# EAGLE design DMD-RaspberryPi (EAGLE 7.7.0)
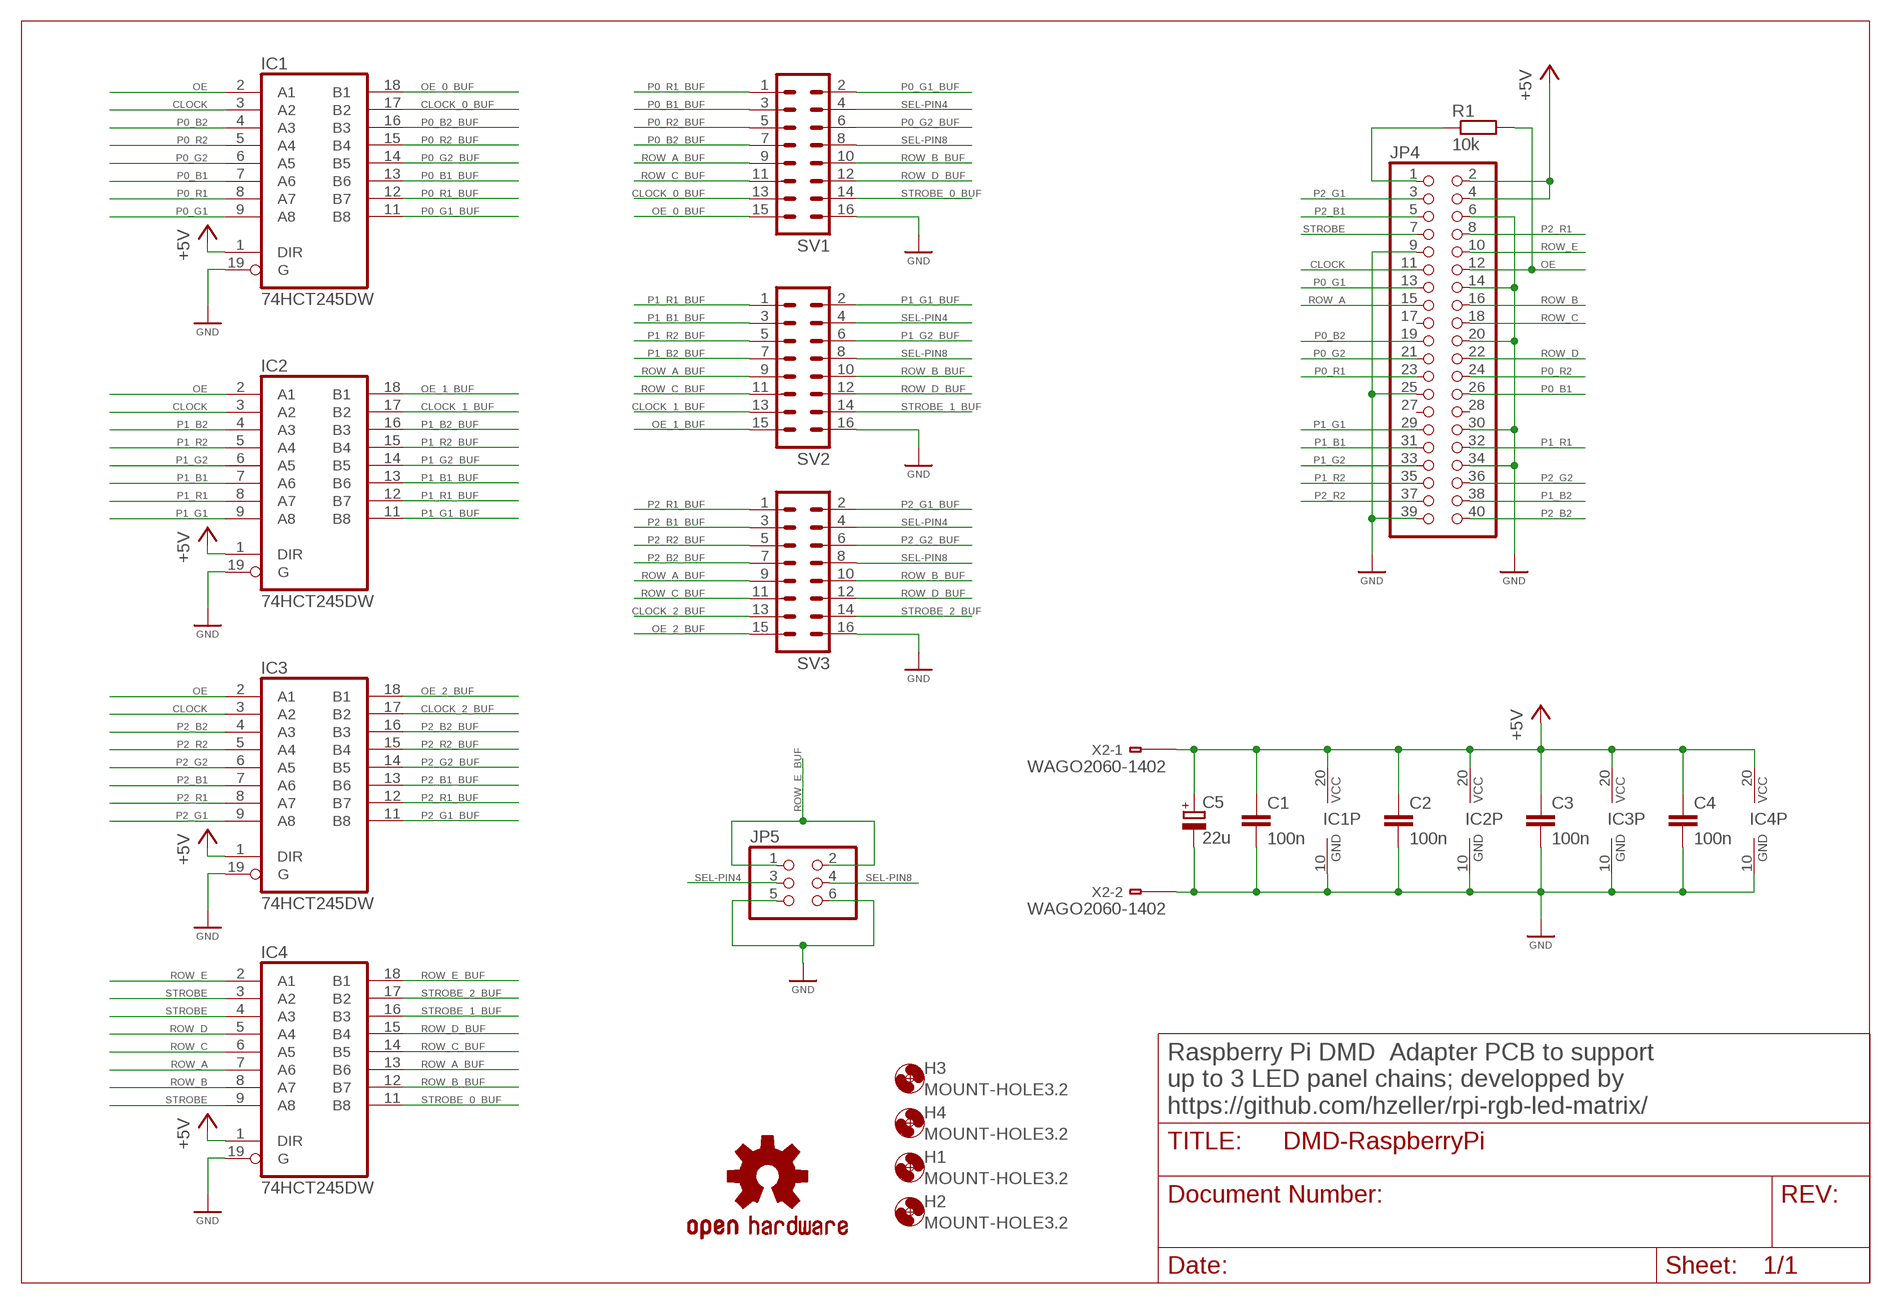
[diagram p0: schematic, sheet 1]

## Parts
C1  100n  C-EUC0805  [C0805]
C2  100n  C-EUC0805  [C0805]
C3  100n  C-EUC0805  [C0805]
C4  100n  C-EUC0805  [C0805]
C5  22u  CPOL-EUC  [PANASONIC_C]
H1  MOUNT-HOLE3.2  [3,2]
H2  MOUNT-HOLE3.2  [3,2]
H3  MOUNT-HOLE3.2  [3,2]
H4  MOUNT-HOLE3.2  [3,2]
IC1  74HCT245DW  [SO20W]
IC2  74HCT245DW  [SO20W]
IC3  74HCT245DW  [SO20W]
IC4  74HCT245DW  [SO20W]
JP4  PINHD-2X20  [2X20]
JP5  PINHD-2X3  [2X03]
LOGO1  OSHW-LOGOL-COPPER  [OSHW-LOGO-L_COPPER]
R1  10k  R-EU_R0805  [R0805]
SV1  ML16  [ML16]
SV2  ML16  [ML16]
SV3  ML16  [ML16]
X2  WAGO2060-1402  [THT_RM4_2]

## Nets
+5V: C1.1 C2.1 C3.1 C4.1 C5.+ IC1.1(DIR) IC1.20(VCC) IC2.1(DIR) IC2.20(VCC) IC3.1(DIR) IC3.20(VCC) IC4.1(DIR) IC4.20(VCC) JP4.2 JP4.4 X2.A2(-1:PIN)
CLOCK: IC1.3(A2) IC2.3(A2) IC3.3(A2) JP4.11
CLOCK_0_BUF: IC1.17(B2) SV1.13
CLOCK_1_BUF: IC2.17(B2) SV2.13
CLOCK_2_BUF: IC3.17(B2) SV3.13
GND: C1.2 C2.2 C3.2 C4.2 C5.- IC1.10(GND) IC1.19(G) IC2.10(GND) IC2.19(G) IC3.10(GND) IC3.19(G) IC4.10(GND) IC4.19(G) JP4.6 JP4.9 JP4.14 JP4.20 JP4.25 JP4.30 JP4.34 JP4.39 JP5.5 JP5.6 SV1.16 SV2.16 SV3.16 X2.B2(-2:PIN)
N$6: JP4.1 R1.1
OE: IC1.2(A1) IC2.2(A1) IC3.2(A1) JP4.12 R1.2
OE_0_BUF: IC1.18(B1) SV1.15
OE_1_BUF: IC2.18(B1) SV2.15
OE_2_BUF: IC3.18(B1) SV3.15
P0_B1: IC1.7(A6) JP4.26
P0_B1_BUF: IC1.13(B6) SV1.3
P0_B2: IC1.4(A3) JP4.19
P0_B2_BUF: IC1.16(B3) SV1.7
P0_G1: IC1.9(A8) JP4.13
P0_G1_BUF: IC1.11(B8) SV1.2
P0_G2: IC1.6(A5) JP4.21
P0_G2_BUF: IC1.14(B5) SV1.6
P0_R1: IC1.8(A7) JP4.23
P0_R1_BUF: IC1.12(B7) SV1.1
P0_R2: IC1.5(A4) JP4.24
P0_R2_BUF: IC1.15(B4) SV1.5
P1_B1: IC2.7(A6) JP4.31
P1_B1_BUF: IC2.13(B6) SV2.3
P1_B2: IC2.4(A3) JP4.38
P1_B2_BUF: IC2.16(B3) SV2.7
P1_G1: IC2.9(A8) JP4.29
P1_G1_BUF: IC2.11(B8) SV2.2
P1_G2: IC2.6(A5) JP4.33
P1_G2_BUF: IC2.14(B5) SV2.6
P1_R1: IC2.8(A7) JP4.32
P1_R1_BUF: IC2.12(B7) SV2.1
P1_R2: IC2.5(A4) JP4.35
P1_R2_BUF: IC2.15(B4) SV2.5
P2_B1: IC3.7(A6) JP4.5
P2_B1_BUF: IC3.13(B6) SV3.3
P2_B2: IC3.4(A3) JP4.40
P2_B2_BUF: IC3.16(B3) SV3.7
P2_G1: IC3.9(A8) JP4.3
P2_G1_BUF: IC3.11(B8) SV3.2
P2_G2: IC3.6(A5) JP4.36
P2_G2_BUF: IC3.14(B5) SV3.6
P2_R1: IC3.8(A7) JP4.8
P2_R1_BUF: IC3.12(B7) SV3.1
P2_R2: IC3.5(A4) JP4.37
P2_R2_BUF: IC3.15(B4) SV3.5
ROW_A: IC4.7(A6) JP4.15
ROW_A_BUF: IC4.13(B6) SV1.9 SV2.9 SV3.9
ROW_B: IC4.8(A7) JP4.16
ROW_B_BUF: IC4.12(B7) SV1.10 SV2.10 SV3.10
ROW_C: IC4.6(A5) JP4.18
ROW_C_BUF: IC4.14(B5) SV1.11 SV2.11 SV3.11
ROW_D: IC4.5(A4) JP4.22
ROW_D_BUF: IC4.15(B4) SV1.12 SV2.12 SV3.12
ROW_E: IC4.2(A1) JP4.10
ROW_E_BUF: IC4.18(B1) JP5.1 JP5.2
SEL-PIN4: JP5.3 SV1.4 SV2.4 SV3.4
SEL-PIN8: JP5.4 SV1.8 SV2.8 SV3.8
STROBE: IC4.3(A2) IC4.4(A3) IC4.9(A8) JP4.7
STROBE_0_BUF: IC4.11(B8) SV1.14
STROBE_1_BUF: IC4.16(B3) SV2.14
STROBE_2_BUF: IC4.17(B2) SV3.14
Unconnected: JP4.17 JP4.27 JP4.28 X2.A1(-1:PIN) X2.B1(-2:PIN)

## Notes on the sheet
- Raspberry Pi DMD  Adapter PCB to support
  up to 3 LED panel chains; developped by
  https://github.com/hzeller/rpi-rgb-led-matrix/

## Library data of the parts
C1-C4 = rcl:C-EU: CAPACITOR, European symbol
C5 = rcl:CPOL-EU: POLARIZED CAPACITOR, European symbol
H1-H4 = holes:MOUNT-HOLE: MOUNTING HOLE with drill center marker
IC1-IC4 = 74xx-eu:74*245: Octal BUS TRANSCEIVER, 3-state
JP4 = pinheader:PINHD-2X20: PIN HEADER
JP5 = pinhead:PINHD-2X3: PIN HEADER
LOGO1 = SparkFun-Aesthetics:OSHW-LOGO: Open-Source Hardware (OSHW) Logo This logo indicates the piece of hardware it is found on incorporates a OSHW license and/or adheres to the definition of open source hardware found here: http://freedomdefined.org/OSHW
R1 = resistor:R-EU_: RESISTOR, European symbol
SV1-SV3 = con-harting-ml:ML16: HARTING; OC_FARNELL: unknown; OC_NEWARK: unknown
X2 = con-wago-2060:WAGO2060-1402: WAGO Cage Clamp THR-Leiterplattenklemmen mit Betätigungsdrückern, 0,75 mm2 Eindrähtige Leiter anschließen – direkt stecken. Feindrähtige Leiter anschließen und Leiter lösen – durch geringen Druck auf den Betätigungsdrücker, z.B. mit Betätigungswerkzeug 206-860. Klemmen polverlustfrei nebeneinander positionierbar. Rastermaß 4 mm / 0.157 in 0,2 – 0,75 mm2 AWG 24 – 18 160 V/2,5 kV/2 9 A lichtgrau: 1pol. 2060-1401 / 2pol. 2060-1402 / 3pol. 2060-1403 schwarz: 1pol. 2060-1421 / 2pol. 2060-1422 / 3pol. 2060-1423

## Board
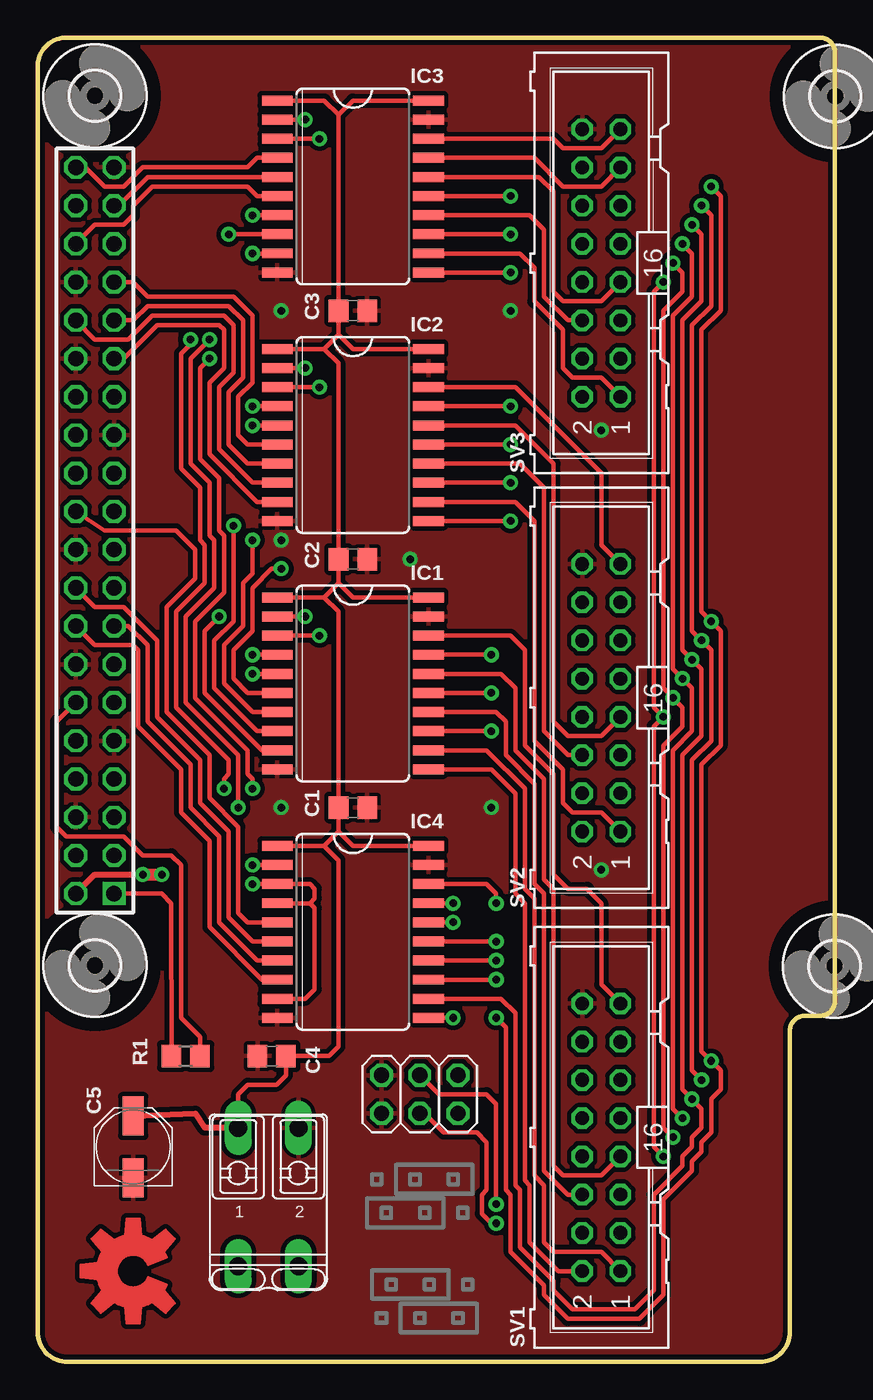
[diagram p1: board, top side]
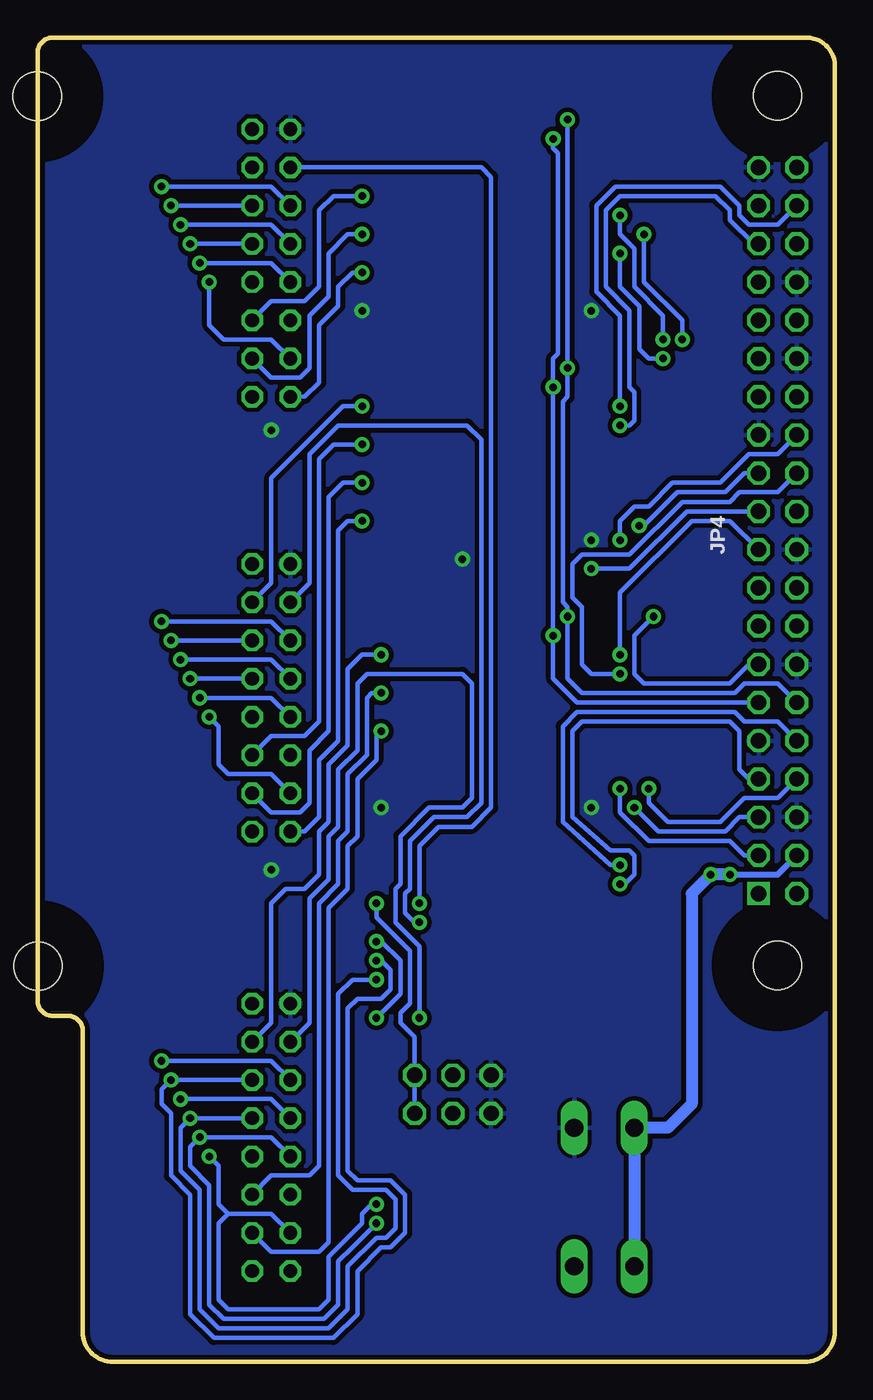
[diagram p2: board, bottom side, seen from below]

Size 53 x 88 mm. Coordinates in mm from the lower left corner, seen from the top.
Outline: 53,86.25 53,87 arc90 52,88 2,88 arc95 0,86 0,2 arc90 2,0 48,0 arc90 50,2 50,22 arc-90 51,23 52,23 arc90 53,24 53,24.25 53,86.25
Outline: 53,86.25 53,85.85
Copper layers (1*16): Top 0.035mm / dielectric 1.5mm / Bottom 0.035mm
Design rules "Elecrow_2-layer_eagle_rule": minimum track width 6mil, minimum drill 12mil, track to track 6mil, track to pad 6mil, pad to pad 6mil, via to via 6mil, smd to smd 0mil, copper to edge 10mil, drill to drill 10mil, minimum pad ring 10mil, minimum via ring 6mil, stop-mask expansion 2mil, vias tented up to drill 100mil, thermal gap 10mil

### Footprints (pad centres in the part's own frame; a part is rotated, then mirrored left to right if it is on the bottom)
C0805 = smd 1.3 x 1.5: 1 -0.95,0; 2 0.95,0
PANASONIC_C = smd 2.6 x 1.4: + 2.05,0; - -2.05,0
3,2 = hole 3.2: 0,0
SO20W = smd 0.66 x 2.032: 1 -5.715,-5.029; 2 -4.445,-5.029; 3 -3.175,-5.029; 4 -1.905,-5.029; 5 -0.635,-5.029; 6 0.635,-5.029; 7 1.905,-5.029; 8 3.175,-5.029; 9 4.445,-5.029; 10 5.715,-5.029; 11 5.715,5.029; 12 4.445,5.029; 13 3.175,5.029; 14 1.905,5.029; 15 0.635,5.029; 16 -0.635,5.029; 17 -1.905,5.029; 18 -3.175,5.029; 19 -4.445,5.029; 20 -5.715,5.029
2X20 = drill 1.016 square: 1 -24.13,-1.27 | drill 1.016 octagon: 2 -24.13,1.27; 3 -21.59,-1.27; 4 -21.59,1.27; 5 -19.05,-1.27; 6 -19.05,1.27; 7 -16.51,-1.27; 8 -16.51,1.27; 9 -13.97,-1.27; 10 -13.97,1.27; 11 -11.43,-1.27; 12 -11.43,1.27; 13 -8.89,-1.27; 14 -8.89,1.27; 15 -6.35,-1.27; 16 -6.35,1.27; 17 -3.81,-1.27; 18 -3.81,1.27; 19 -1.27,-1.27; 20 -1.27,1.27; 21 1.27,-1.27; 22 1.27,1.27; 23 3.81,-1.27; 24 3.81,1.27; 25 6.35,-1.27; 26 6.35,1.27; 27 8.89,-1.27; 28 8.89,1.27; 29 11.43,-1.27; 30 11.43,1.27; 31 13.97,-1.27; 32 13.97,1.27; 33 16.51,-1.27; 34 16.51,1.27; 35 19.05,-1.27; 36 19.05,1.27; 37 21.59,-1.27; 38 21.59,1.27; 39 24.13,-1.27; 40 24.13,1.27
2X03 = drill 1.016 octagon: 1 -2.54,-1.27; 2 -2.54,1.27; 3 0,-1.27; 4 0,1.27; 5 2.54,-1.27; 6 2.54,1.27
R0805 = smd 1.3 x 1.5: 1 -0.95,0; 2 0.95,0
ML16 = drill 0.914 octagon: 1 -8.89,-1.27; 2 -8.89,1.27; 3 -6.35,-1.27; 4 -6.35,1.27; 5 -3.81,-1.27; 6 -3.81,1.27; 7 -1.27,-1.27; 8 -1.27,1.27; 9 1.27,-1.27; 10 1.27,1.27; 11 3.81,-1.27; 12 3.81,1.27; 13 6.35,-1.27; 14 6.35,1.27; 15 8.89,-1.27; 16 8.89,1.27
THT_RM4_2 = drill 1.2 long: A1 0,0; A2 0,9.2; B1 4,0; B2 4,9.2

### Placement (x,y rotation side)
C1  20.95,36.83 0 top
C2  20.95,53.34 0 top
C3  20.95,69.85 0 top
C4  15.56,20.32 180 top
C5  6.35,14.29 90 top
H1  3.81,84.14 0 top
H2  3.81,26.35 0 top
H3  53.03,84.1 0 top
H4  52.97,26.3 0 top
IC1  20.95,45.09 270 top
IC2  20.95,61.59 270 top
IC3  20.95,78.11 270 top
IC4  20.95,28.57 270 top
JP4  3.81,55.24 90 top
JP5  25.4,17.78 180 top
LOGO1  6.35,6.03 90 top
R1  9.84,20.32 0 top
SV1  37.47,14.92 90 top
SV2  37.47,44.13 90 top
SV3  37.47,73.03 90 top
X2  13.34,6.35 0 top

### Tracks (layer width: path | path; a pad name or v marks a point on that pad's centre or on a via)
+5V  (via drill 0.5 pad 1)
  Top 0.305: IC2.1 19.05,67.31 | 19.05,67.31 20,68.26 | 19.05,67.31 20,66.36 C2.1 20,51.75 | 19.05,50.8 20,49.85 C1.1 20,35.24 | 19.05,50.8 IC1.1 | 20,51.75 19.05,50.8 | 19.05,34.29 20,33.34 20,20.95 19.37,20.32 C4.1 | 19.05,34.29 IC4.1 | 20,35.24 19.05,34.29 | 20,68.26 C3.1 20,82.87 | 20,68.26 20.95,67.31 IC2.20 | 20,82.87 19.05,83.82 IC3.1 | 20,82.87 20.95,83.82 IC3.20 | IC1.20 20.95,50.8 20,51.75 | IC4.20 20.95,34.29 20,35.24 | C4.1 | X2.A2 13.34,17.78 13.97,18.41 15.88,18.41 16.51,19.05 C4.1
  Top 0.406: C5.+ 10.48,16.51 11.11,15.56 X2.A2 | JP4.2 3.81,32.38 v6.99,32.38
  Top 0.813: v6.99,32.38 v8.26,32.38
  Bottom 0.406: v6.99,32.38 3.81,32.38 JP4.4
  Bottom 0.813: v6.99,32.38 v8.26,32.38 9.53,31.11 9.53,17.14 11.11,15.56 X2.A2 13.34,6.35
CLOCK  (via drill 0.5 pad 1)
  Top 0.305: IC1.3 v18.73,48.26 | v18.73,64.77 IC2.3 | IC3.3 v18.73,81.28
  Bottom 0.305: JP4.11 17.14,43.81 18.73,45.4 v18.73,48.26 v18.73,64.77 18.73,66.67 18.41,66.99 18.41,80.33 18.73,80.64 v18.73,81.28
CLOCK_0_BUF  (via drill 0.5 pad 1)
  Top 0.305: IC1.17 27.3,46.99 27.94,46.99 29.84,46.99 v30.16,46.99
  Bottom 0.305: v30.16,46.99 31.43,46.99 32.38,46.04 32.38,40.96 33.66,39.69 33.66,35.88 34.29,35.24 34.29,32.38 35.24,31.43 36.51,31.43 37.47,30.48 37.47,22.54 SV1.13
CLOCK_1_BUF  (via drill 0.5 pad 1)
  Top 0.305: IC2.17 27.3,63.5 27.62,63.5 31.11,63.5 v31.43,63.5
  Bottom 0.305: SV2.13 37.47,51.75 37.47,58.74 32.7,63.5 v31.43,63.5
CLOCK_2_BUF
  Top 0.305: IC3.17 27.3,80.01 27.94,80.01 33.02,80.01 34.92,78.11 37.47,78.11 SV3.13
GND  (via drill 0.5 pad 1)
  other vias: 16.19,54.61 16.19,69.85 16.19,36.83 24.77,53.34 30.16,36.83 31.43,69.85 37.47,61.91 37.47,32.7
  pour Top (isolate 0.305): -7.62,94.09 -7.62,-9.46 63.5,-9.14 63.5,94.09
  pour Bottom (isolate 0.305): -7.62,94.73 -7.62,-9.14 63.18,-9.46 63.18,94.41
N$6
  Top 0.305: R1.1 8.89,30.48 8.26,31.11 JP4.1
OE  (via drill 0.5 pad 1)
  Top 0.305: IC3.2 v17.78,82.55 | v17.78,66.04 IC2.2 | IC1.2 v17.78,49.53 | JP4.12 1.27,42.55 1.27,35.56 1.91,34.92 5.71,34.92 6.99,33.66 8.89,33.66 9.53,33.02 9.53,22.86 10.79,21.59 R1.2
  Bottom 0.305: v17.78,82.55 v17.78,66.04 17.78,64.14 18.1,63.82 18.1,50.48 17.78,50.16 v17.78,49.53 17.78,45.4 16.83,44.45 6.67,44.45 6.03,45.09 3.81,45.09 JP4.12
OE_0_BUF
  Top 0.305: IC1.18 27.3,48.26 27.62,48.26 27.94,48.26 31.43,48.26 32.38,47.31 32.38,40.96 34.29,39.05 34.29,32.38 35.24,31.43 36.51,31.43 37.47,30.48 37.47,25.08 SV1.15
OE_1_BUF
  Top 0.305: IC2.18 27.3,64.77 31.75,64.77 32.38,64.14 37.47,59.05 37.47,58.42 37.47,54.29 SV2.15
OE_2_BUF
  Top 0.305: IC3.18 27.3,81.28 34.29,81.28 | 34.29,81.28 34.92,80.64 | 34.92,80.64 34.29,81.28 | 34.29,81.28 34.92,80.64 | 34.92,80.64 37.47,80.64 SV3.15
P0_B1  (via drill 0.5 pad 1)
  Top 0.305: IC1.7 14.29,43.18 12.38,45.09 12.38,47.62 13.65,48.9 13.65,51.75 14.29,52.39 v14.29,54.61
  Bottom 0.305: JP4.26 3.81,60.33 5.71,60.33 7.62,58.42 10.79,58.42 12.38,56.83 13.34,56.83 14.29,55.88 v14.29,54.61
P0_B1_BUF  (via drill 0.5 pad 1)
  Top 0.305: IC1.13 27.3,41.91 29.53,41.91 v30.16,41.91
  Bottom 0.305: v30.16,41.91 30.48,41.59 30.48,40.01 31.75,38.73 31.75,34.92 32.38,34.29 32.38,31.43 33.66,30.16 33.66,7.94 34.29,7.3 37.47,7.3 SV1.3
P0_B2  (via drill 0.5 pad 1)
  Top 0.305: IC1.4 v14.29,46.99
  Bottom 0.305: v14.29,46.99 14.29,51.12 9.53,55.88 6.99,55.88 JP4.19
P0_B2_BUF
  Top 0.305: IC1.16 27.3,45.72 30.8,45.72 31.75,44.77 31.75,40.64 33.66,38.73 33.66,32.07 34.29,31.43 34.29,13.02 34.92,12.38 37.47,12.38 SV1.7
P0_G1  (via drill 0.5 pad 1)
  Top 0.305: IC1.9 14.92,40.64 11.11,44.45 11.11,48.58 v12.06,49.53
  Bottom 0.305: JP4.13 5.71,46.35 6.99,45.09 12.7,45.09 13.34,45.72 13.34,48.26 v12.06,49.53
P0_G1_BUF
  Top 0.305: IC1.11 30.16,39.37 31.75,37.78 31.75,31.11 32.38,30.48 32.38,12.06 32.7,11.75 32.7,7.94 34.61,6.03 SV1.2
P0_G2  (via drill 0.5 pad 1)
  Top 0.305: IC1.6 13.97,44.45 13.02,45.4 13.02,47.31 14.29,48.58 14.29,51.44 15.56,52.7 v16.19,52.7
  Bottom 0.305: JP4.21 9.84,56.52 13.65,52.7 v16.19,52.7
P0_G2_BUF
  Top 0.305: IC1.14 27.3,43.18 30.48,43.18 31.11,42.55 31.11,40.32 33.02,38.42 33.02,31.75 33.66,31.11 33.66,12.7 35.24,11.11 SV1.6
P0_R1  (via drill 0.5 pad 1)
  Top 0.305: IC1.8 14.61,41.91 11.75,44.77 11.75,47.94 13.02,49.21 v13.02,55.56
  Bottom 0.305: JP4.23 6.03,59.05 7.3,57.78 10.48,57.78 12.7,55.56 v13.02,55.56
P0_R1_BUF
  Top 0.305: IC1.12 26.99,40.64 29.84,40.64 32.38,38.1 32.38,31.43 33.02,30.8 33.02,12.38 33.66,11.75 33.66,7.94 34.29,7.3 37.47,7.3 SV1.1
P0_R2  (via drill 0.5 pad 1)
  Top 0.305: IC1.5 v14.29,45.72
  Bottom 0.305: JP4.24 3.81,57.78 6.35,57.78 6.99,57.15 10.16,57.15 13.65,53.66 16.83,53.66 17.46,53.02 17.46,50.8 16.83,50.16 16.83,46.35 16.19,45.72 v14.29,45.72
P0_R2_BUF  (via drill 0.5 pad 1)
  Top 0.305: IC1.15 27.3,44.45 27.62,44.45 29.84,44.45 v30.16,44.45
  Bottom 0.305: v30.16,44.45 30.8,44.45 31.11,44.13 31.11,40.32 32.38,39.05 32.38,35.24 33.02,34.61 33.02,31.75 34.29,30.48 34.29,13.02 34.92,12.38 37.47,12.38 SV1.5
P1_B1
  Top 0.305: IC2.7 13.97,59.69 12.7,60.96 12.7,64.45 13.65,65.41 13.65,69.22 12.7,70.17 7.3,70.17 6.35,69.22 JP4.31
P1_B1_BUF  (via drill 0.5 pad 1)
  Top 0.305: 25.72,58.42 IC2.13 27.3,58.42 27.62,58.42 31.11,58.42 v31.43,58.42
  Bottom 0.305: v31.43,58.42 32.7,58.42 33.66,57.47 33.66,41.91 34.92,40.64 34.92,37.15 35.56,36.51 37.47,36.51 SV2.3
P1_B2  (via drill 0.5 pad 1)
  Top 0.305: v14.29,63.5 IC2.4
  Bottom 0.305: v14.29,63.5 14.29,69.53 15.88,71.12 15.88,76.83 14.61,78.11 7.62,78.11 6.35,76.83 6.35,76.2 5.71,75.56 3.81,75.56 JP4.38
P1_B2_BUF
  Top 0.305: SV2.7 37.47,41.59 35.24,41.59 34.29,42.55 34.29,59.69 31.75,62.23 27.3,62.23 IC2.16
P1_G1
  Top 0.305: JP4.29 5.71,66.67 7.94,68.9 12.06,68.9 12.38,68.58 12.38,66.04 11.43,65.09 11.43,60.33 14.61,57.15 IC2.9
P1_G1_BUF  (via drill 0.5 pad 1)
  Top 0.305: v31.43,55.88 31.11,55.88 27.62,55.88 27.3,55.88 IC2.11
  Bottom 0.305: SV2.2 35.24,35.24 34.29,36.2 34.29,40.01 33.02,41.27 33.02,55.24 32.38,55.88 v31.43,55.88
P1_G2
  Top 0.305: IC2.6 13.97,60.96 13.34,61.59 13.34,64.14 14.29,65.09 14.29,69.53 13.02,70.8 7.3,70.8 6.35,71.75 JP4.33
P1_G2_BUF
  Top 0.305: IC2.14 27.3,59.69 32.07,59.69 33.66,58.1 33.66,41.91 35.24,40.32 SV2.6
P1_R1
  Top 0.305: JP4.32 3.81,67.94 6.03,67.94 7.62,69.53 12.38,69.53 13.02,68.9 13.02,65.72 12.06,64.77 12.06,60.64 14.29,58.42 IC2.8
P1_R1_BUF
  Top 0.305: IC2.12 27.3,57.15 31.75,57.15 33.02,55.88 33.02,41.27 34.92,39.37 34.92,37.15 35.56,36.51 37.47,36.51 SV2.1
P1_R2  (via drill 0.5 pad 1)
  Top 0.305: IC2.5 v14.29,62.23
  Bottom 0.305: v14.29,62.23 13.65,62.23 13.34,62.55 13.34,64.45 13.65,64.77 13.65,69.85 15.24,71.44 15.24,76.52 14.29,77.47 7.94,77.47 6.99,76.52 6.99,75.88 5.4,74.3 JP4.35
P1_R2_BUF  (via drill 0.5 pad 1)
  Top 0.305: 25.72,60.96 IC2.15 27.3,60.96 27.62,60.96 31.11,60.96 v31.43,60.96
  Bottom 0.305: SV2.5 37.47,41.59 35.24,41.59 34.29,42.55 34.29,60.01 33.34,60.96 v31.43,60.96
P2_B1  (via drill 0.5 pad 1)
  Top 0.305: IC3.7 v14.29,76.2 | v13.34,36.83 13.34,40.32 9.84,43.81 9.84,49.53 11.75,51.44 11.75,54.61 11.43,54.93 11.43,58.42 10.16,59.69 10.16,66.67 v11.43,67.94
  Bottom 0.305: JP4.5 6.35,36.2 7.3,35.24 11.75,35.24 v13.34,36.83 | v11.43,67.94 11.43,69.53 13.34,71.44 13.34,73.98 14.29,74.93 v14.29,76.2
P2_B1_BUF  (via drill 0.5 pad 1)
  Top 0.305: IC3.13 27.3,74.93 27.62,74.93 31.11,74.93 v31.43,74.93
  Bottom 0.305: v31.43,74.93 32.38,74.93 33.66,73.66 33.66,70.8 34.92,69.53 34.92,66.04 35.56,65.41 37.47,65.41 SV3.3
P2_B2
  Top 0.305: JP4.40 3.17,79.38 4.45,78.11 5.71,78.11 6.99,79.38 13.97,79.38 14.61,80.01 IC3.4
P2_B2_BUF
  Top 0.305: IC3.16 27.3,78.74 33.34,78.74 34.29,77.79 34.29,71.12 34.92,70.48 37.47,70.48 SV3.7
P2_G1  (via drill 0.5 pad 1)
  Top 0.305: IC3.9 v14.29,73.66 | v14.29,38.1 14.29,38.73 13.97,39.05 13.97,40.64 10.48,44.13 10.48,49.21 12.38,51.12 12.38,54.93 12.06,55.24 12.06,58.74 10.79,60.01 10.79,66.04 v11.43,66.67
  Bottom 0.305: JP4.3 6.03,33.66 6.99,34.61 12.38,34.61 14.29,36.51 v14.29,38.1 | v11.43,66.67 12.06,66.67 12.38,66.67 13.02,67.31 13.02,70.17 14.29,71.44 v14.29,73.66
P2_G1_BUF  (via drill 0.5 pad 1)
  Top 0.305: 25.08,72.39 IC3.11 27.3,72.39 27.62,72.39 31.11,72.39 v31.43,72.39
  Bottom 0.305: v31.43,72.39 32.07,72.39 33.02,71.44 33.02,70.17 34.29,68.9 34.29,65.09 35.24,64.14 SV3.2
P2_G2
  Top 0.305: IC3.6 14.61,77.47 13.97,78.11 7.62,78.11 6.35,76.83 6.35,76.2 5.71,75.56 3.81,75.56 JP4.36
P2_G2_BUF
  Top 0.305: IC3.14 27.3,76.2 32.7,76.2 33.66,75.25 33.66,70.8 35.24,69.22 SV3.6
P2_R1  (via drill 0.5 pad 1)
  Top 0.305: IC3.8 v12.7,74.93 | v12.38,38.1 12.38,38.73 12.7,39.05 12.7,40.01 9.21,43.5 9.21,49.85 11.11,51.75 11.11,54.29 10.79,54.61 10.79,58.1 9.53,59.37 9.53,66.99 10.16,67.63 v10.16,67.94
  Bottom 0.305: JP4.8 3.81,37.47 6.03,37.47 7.62,35.88 11.11,35.88 12.38,37.15 v12.38,38.1 | v10.16,67.94 10.16,69.22 12.7,71.75 v12.7,74.93
P2_R1_BUF
  Top 0.305: IC3.12 27.3,73.66 32.07,73.66 33.02,72.71 33.02,70.48 34.92,68.58 34.92,66.04 35.56,65.41 37.47,65.41 SV3.1
P2_R2
  Top 0.305: IC3.5 7.3,78.74 5.4,76.83 JP4.37
P2_R2_BUF  (via drill 0.5 pad 1)
  Top 0.305: IC3.15 27.3,77.47 27.62,77.47 31.11,77.47 v31.43,77.47
  Bottom 0.305: v31.43,77.47 33.34,77.47 34.29,76.52 34.29,71.44 35.24,70.48 37.47,70.48 SV3.5
ROW_A
  Top 0.305: IC4.7 14.61,26.67 12.06,29.21 12.06,34.92 10.16,36.83 10.16,39.69 7.3,42.55 7.3,47.62 6.03,48.9 JP4.15
ROW_A_BUF  (via drill 0.5 pad 1)
  Top 0.305: v42.86,74.3 43.5,73.66 43.5,70.8 42.23,69.53 42.23,46.04 v42.86,45.4 43.5,44.77 43.5,41.91 42.23,40.64 42.23,16.83 v42.86,16.19 | IC4.13 27.3,25.4 28.26,25.4 29.84,25.4 30.16,25.4 v30.48,25.4
  Bottom 0.305: SV3.9 v42.86,74.3 | SV2.9 v42.86,45.4 | SV1.9 v42.86,16.19 43.5,15.56 43.5,12.7 42.23,11.43 42.23,3.49 40.96,2.22 33.66,2.22 32.38,3.49 32.38,6.35 30.48,8.26 29.84,8.26 29.21,8.89 29.21,10.79 29.84,11.43 32.07,11.43 33.02,12.38 33.02,24.45 32.07,25.4 v30.48,25.4
ROW_B
  Top 0.305: IC4.8 14.92,25.4 11.43,28.89 11.43,34.61 9.53,36.51 9.53,39.37 6.67,42.23 6.67,47.31 6.35,47.62 3.81,47.62 JP4.16
ROW_B_BUF  (via drill 0.5 pad 1)
  Top 0.305: v43.5,75.56 44.13,74.93 44.13,70.48 42.86,69.22 42.86,47.31 v43.5,46.67 44.13,46.04 44.13,41.59 42.86,40.32 42.86,18.1 v43.5,17.46 44.13,16.83 44.13,15.56 43.5,14.92 43.5,14.29 42.86,13.65 42.86,13.02 40.96,11.11 40.96,4.76 39.69,3.49 35.56,3.49 34.29,4.76 34.29,5.4 32.07,7.62 32.07,11.43 31.75,11.75 31.75,23.18 30.8,24.13 IC4.12
  Bottom 0.305: SV3.10 37.47,75.56 v43.5,75.56 | SV2.10 37.47,46.67 v43.5,46.67 | SV1.10 37.47,17.46 v43.5,17.46
ROW_C
  Top 0.305: IC4.6 14.29,27.94 12.7,29.53 12.7,35.24 10.79,37.15 10.79,40.01 7.94,42.86 7.94,47.94 5.71,50.16 3.81,50.16 JP4.18
ROW_C_BUF  (via drill 0.5 pad 1)
  Top 0.305: v44.13,76.83 44.77,76.2 44.77,70.17 43.5,68.9 43.5,48.58 v44.13,47.94 44.77,47.31 44.77,41.27 43.5,40.01 43.5,19.37 v44.13,18.73 | IC4.14 v30.48,26.67
  Bottom 0.305: SV3.11 v44.13,76.83 | v44.13,47.94 SV2.11 | SV1.11 v44.13,18.73 44.77,18.1 44.77,17.14 44.13,16.51 44.13,12.38 42.86,11.11 42.86,3.17 41.27,1.59 33.34,1.59 31.75,3.17 31.75,5.08 31.75,6.03 30.16,7.62 29.53,7.62 28.57,8.57 28.57,11.11 29.53,12.06 31.75,12.06 32.38,12.7 32.38,23.5 31.75,24.13 30.16,24.13 29.53,24.77 29.53,26.04 30.16,26.67 v30.48,26.67
ROW_D
  Top 0.305: IC4.5 13.97,29.21 13.34,29.84 13.34,35.56 11.43,37.47 11.43,40.32 8.57,43.18 8.57,50.16 10.48,52.07 10.48,53.98 9.21,55.24 4.45,55.24 JP4.22
ROW_D_BUF  (via drill 0.5 pad 1)
  Top 0.305: v44.77,78.11 45.4,77.47 45.4,69.85 44.13,68.58 44.13,49.85 v44.77,49.21 45.4,48.58 45.4,40.96 44.13,39.69 44.13,20.64 v44.77,20 45.4,19.37 45.4,18.1 44.77,17.46 44.77,15.24 44.13,14.61 44.13,13.97 43.5,13.34 43.5,12.7 41.59,10.79 41.59,4.45 40.01,2.86 35.24,2.86 33.66,4.45 33.66,5.08 31.43,7.3 31.43,11.11 31.11,11.43 31.11,22.23 v30.48,22.86 | IC4.15 27.3,27.94 27.94,27.94 29.53,27.94 30.16,27.94 v30.48,27.94
  Bottom 0.305: SV3.12 37.47,78.11 v44.77,78.11 | SV2.12 37.47,49.21 v44.77,49.21 | SV1.12 37.47,20 v44.77,20 | v30.48,27.94 30.16,27.94 28.89,26.67 28.89,24.45 v30.48,22.86
ROW_E  (via drill 0.5 pad 1)
  Top 0.305: IC4.2 v14.29,33.02
  Bottom 0.305: JP4.10 3.81,42.55 6.03,42.55 6.67,43.18 17.14,43.18 18.1,42.23 18.1,35.88 14.92,33.02 v14.29,33.02
ROW_E_BUF  (via drill 0.5 pad 1)
  Top 0.305: IC4.18 29.84,31.75 30.48,31.11 v30.48,30.48
  Bottom 0.305: v30.48,30.48 30.48,29.53 28.26,27.3 28.26,23.81 28.89,23.18 28.89,22.54 27.94,21.59 JP5.1 JP5.2
SEL-PIN4  (via drill 0.5 pad 1)
  Top 0.305: v41.59,71.75 40.96,71.12 40.96,43.5 v41.59,42.86 40.96,42.23 40.96,14.29 v41.59,13.65 | JP5.3 26.67,17.78 29.84,17.78 30.48,17.14 v30.48,10.48
  Bottom 0.305: SV3.4 37.47,67.94 40.64,67.94 41.59,68.9 v41.59,71.75 | SV2.4 37.47,39.05 40.32,39.05 40.96,39.69 40.96,42.23 v41.59,42.86 | SV1.4 37.47,9.84 40.32,9.84 | 40.32,9.84 40.96,10.48 40.96,13.02 v41.59,13.65 | v30.48,10.48 30.8,10.48 31.43,9.84 31.43,9.21 33.66,6.99 33.66,4.13 34.29,3.49 40.32,3.49 40.96,4.13 40.96,9.21 40.32,9.84
SEL-PIN8  (via drill 0.5 pad 1)
  Top 0.305: v42.23,73.03 42.86,72.39 42.86,71.12 41.59,69.85 41.59,44.77 v42.23,44.13 42.86,43.5 42.86,42.23 41.59,40.96 41.59,15.56 v42.23,14.92 | JP5.4 25.72,16.51 26.99,15.24 29.21,15.24 29.84,14.61 29.84,11.43 29.53,11.11 29.53,9.84 30.16,9.21 v30.48,9.21
  Bottom 0.305: SV3.8 37.47,73.03 v42.23,73.03 | SV2.8 37.47,44.13 v42.23,44.13 | SV1.8 37.47,14.92 v42.23,14.92 42.86,14.29 42.86,13.02 41.59,11.75 41.59,3.81 40.64,2.86 33.97,2.86 33.02,3.81 33.02,6.67 32.07,7.62 31.43,8.26 30.8,8.89 v30.48,9.21
STROBE  (via drill 0.5 pad 1)
  Top 0.305: IC4.9 17.78,24.13 18.41,24.77 18.41,30.16 18.1,30.48 | 18.1,30.48 IC4.4 | v14.29,31.75 IC4.3 18.1,31.75 18.41,31.43 18.41,30.8 18.1,30.48
  Bottom 0.305: v14.29,31.75 13.97,31.75 13.34,32.38 13.34,33.66 13.65,33.97 14.92,33.97 17.46,36.2 17.46,41.91 16.83,42.55 6.99,42.55 6.35,41.91 6.35,39.37 5.71,38.73 JP4.7
STROBE_0_BUF  (via drill 0.5 pad 1)
  Top 0.305: IC4.11 v27.62,22.86
  Bottom 0.305: SV1.14 34.92,22.54 34.92,30.8 33.66,32.07 33.66,34.92 33.02,35.56 33.02,39.37 31.75,40.64 31.75,45.09 31.11,45.72 24.77,45.72 24.13,45.09 24.13,37.47 24.77,36.83 26.99,36.83 28.89,34.92 28.89,31.75 29.21,31.43 29.21,29.21 27.62,27.62 v27.62,22.86
STROBE_1_BUF  (via drill 0.5 pad 1)
  Top 0.305: v27.62,29.21 IC4.16
  Bottom 0.305: SV2.14 34.92,51.75 34.92,60.33 33.02,62.23 24.45,62.23 23.5,61.28 23.5,37.15 24.45,36.2 26.67,36.2 28.26,34.61 28.26,31.43 28.57,31.11 28.57,29.84 27.94,29.21 v27.62,29.21
STROBE_2_BUF  (via drill 0.5 pad 1)
  Top 0.305: IC4.17 v27.62,30.48
  Bottom 0.305: SV3.14 23.5,79.38 22.86,78.74 22.86,36.83 24.13,35.56 26.35,35.56 27.62,34.29 v27.62,30.48

### Text on the board
tDocu: HUB75 / DMD3 | HUB75 / DMD2 | based on hzeller's active adapter / https://github.com/hzeller/rpi-rgb-led-matrix/ | rev 1, 2018/08 | Raspberry Pi DMD Adapter | 4 | G | E | G | E | <randy@smue.org> | 8 | POWER IN | E on 4 | HUB75 / DMD1 | +5V | GND | E on 8
bDocu: 74HCT245 / 100nF / 22uF / 10k | IC1..4: / C1..4: / C: / R1: